# EAGLE design signal_generator (EAGLE 9.3.1)
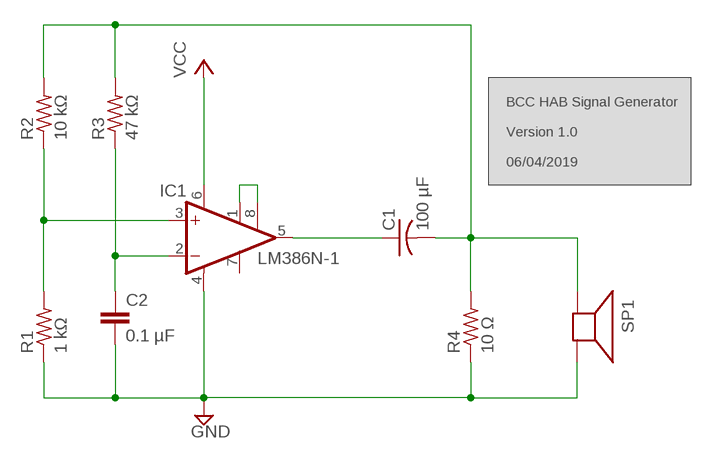
[diagram p0: schematic, sheet 1]

## Parts
C1  100 µF  C-US025-024X044  [C025-024X044]
C2  0.1 µF  C2,5-3  [C2.5-3]
IC1  LM386N-1  [DIL08]
R1  1 kΩ  R-US_0204/7  [0204/7]
R2  10 kΩ  R-US_0204/7  [0204/7]
R3  47 kΩ  R-US_0204/7  [0204/7]
R4  10 Ω  R-US_0204/7  [0204/7]
SP1  SPEAKER/AL60P  [AL60P]

## Nets
GND: C2.2 IC1.4(GND) R1.1 R4.1 SP1.2(-)
OUT: C1.2 R2.2 R3.2 R4.2 SP1.1(+)
PIN1-8: IC1.1(GAIN) IC1.8(GAIN)
PIN2: C2.1 IC1.2(-IN) R3.1
PIN3: IC1.3(+IN) R1.2 R2.1
PIN5: C1.1 IC1.5(OUT)
VCC: IC1.6(VS)
Unconnected: IC1.7(BYPASS)

## Notes on the sheet
- BCC HAB Signal Generator
  
  Version 1.0
  
  06/04/2019

## Library data of the parts
C1 = adafruit:C-US: CAPACITOR, American symbol
C2 = capacitor-wima:C: CAPACITOR naming: grid - package width
IC1 = linear:LM386?-*: Low Voltage Audio Power Amplifier Source: http://cache.national.com/ds/LM/LM386.pdf
R1-R4 = adafruit:R-US_: RESISTOR, American symbol
SP1 = adafruit:SPEAKER: SPEAKER Source: Buerklin Added PS12 (for part # PS1240 piezo) http://www.ladyada.net/library/pcb/eaglelibrary.html

## Board
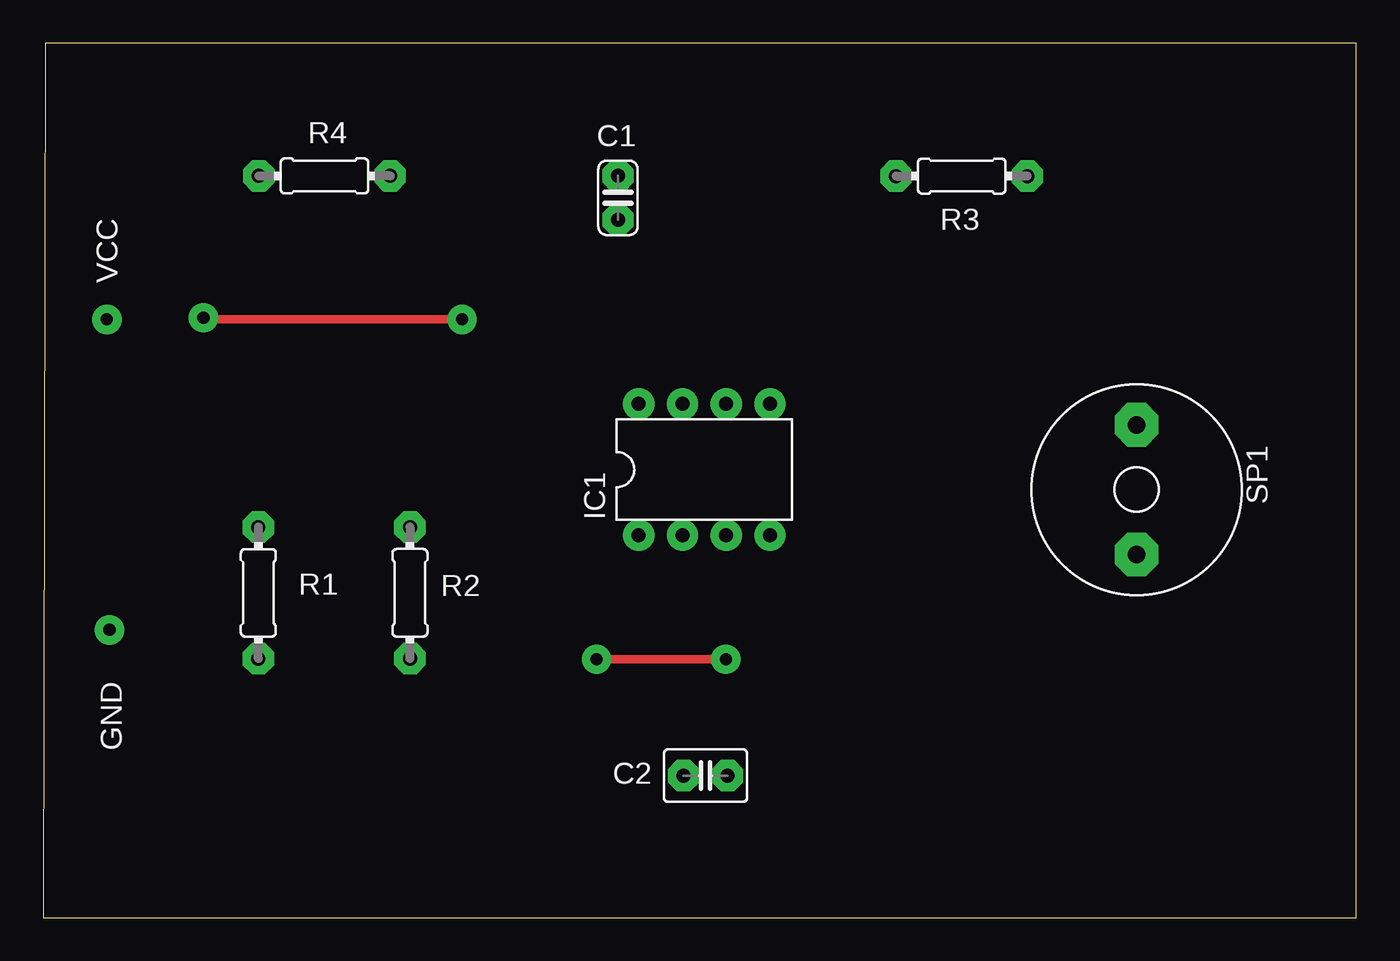
[diagram p1: board, top side]
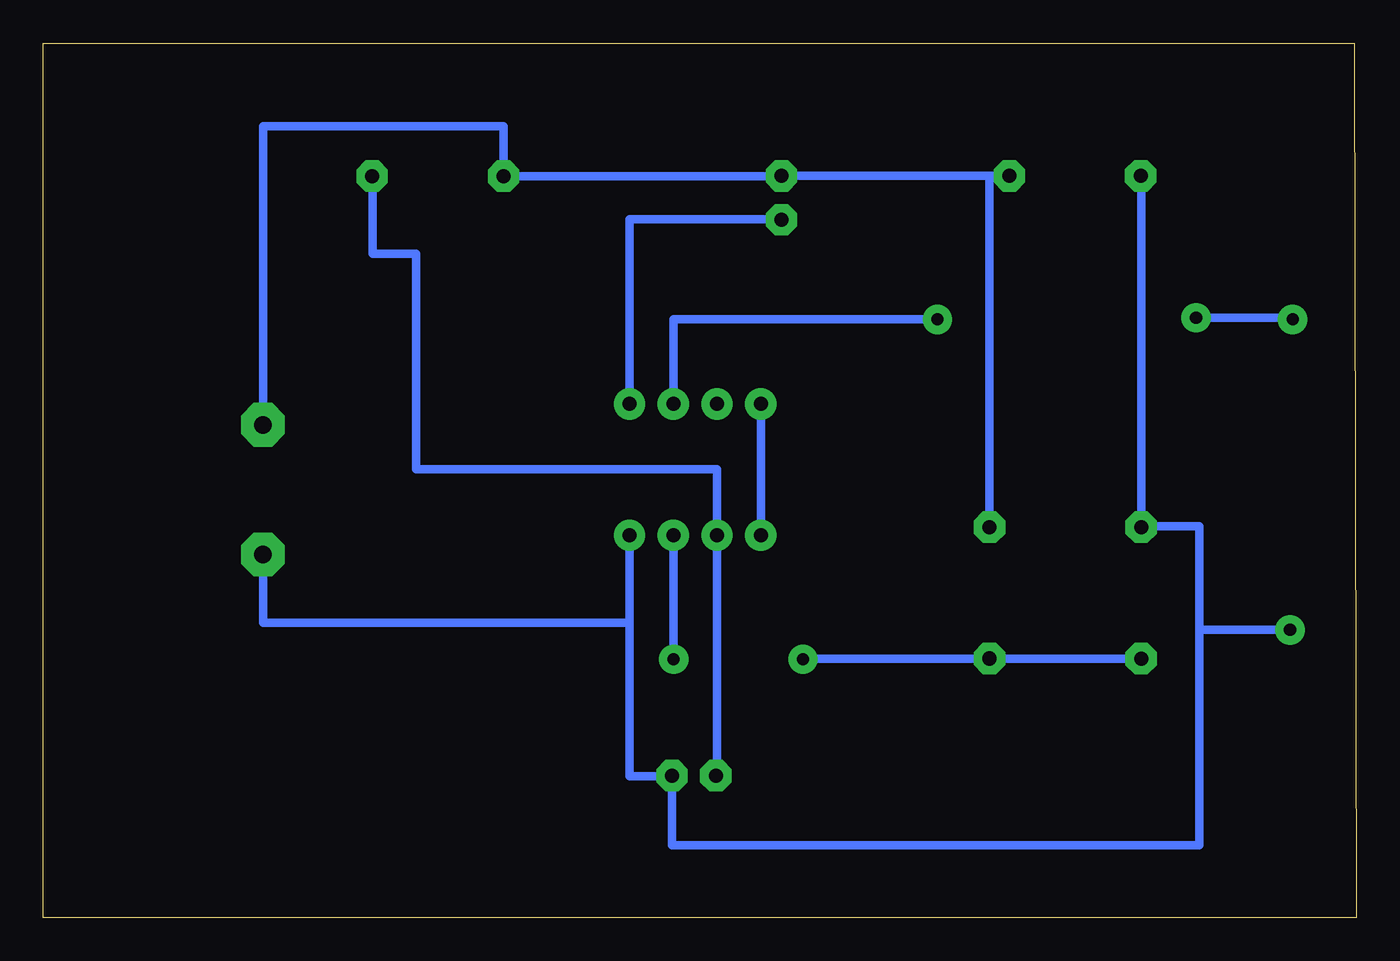
[diagram p2: board, bottom side, seen from below]

Size 76.18 x 50.72 mm. Coordinates in mm from the lower left corner, seen from the top.
Outline: 0,0 76.18,0 76.18,50.72 0.13,50.72 0,0
Copper layers (1*16): Top 0.035mm / dielectric 1.5mm / Bottom 0.035mm
Design rules "voltera-dru *": minimum track width 10mil, minimum drill 0.4mm, track to track 10mil, track to pad 10mil, pad to pad 0.6mm, via to via 0.6mm, smd to smd 0mil, copper to edge 0mil, drill to drill 0.8mm, minimum pad ring 0.5mm, minimum via ring 0.5mm, stop-mask expansion 4mil, vias tented up to drill 0mil, thermal gap 10mil

### Footprints (pad centres in the part's own frame; a part is rotated, then mirrored left to right if it is on the bottom)
C025-024X044 = drill 0.813 pad 1.422 octagon: 1 -1.27,0; 2 1.27,0
C2.5-3 = drill 0.813 pad 1.6 octagon: 1 -1.27,0; 2 1.27,0
DIL08 = drill 0.813 pad 1.27: 1 -3.81,-3.81; 2 -1.27,-3.81; 3 1.27,-3.81; 4 3.81,-3.81; 5 3.81,3.81; 6 1.27,3.81; 7 -1.27,3.81; 8 -3.81,3.81
0204/7 = drill 0.813 pad 1.676 octagon: 1 -3.81,0; 2 3.81,0
AL60P = drill 1.016 pad 2.54 octagon: 1 -3.759,0; 2 3.759,0

### Placement (x,y rotation side)
C1  33.35,41.75 90 top
C2  38.43,8.25 0 top
IC1  38.36,25.99 0 top
R1  12.49,18.85 270 top
R2  21.28,18.85 90 top
R3  53.28,43.01 180 top
R4  16.32,43.02 0 top
SP1  63.43,24.83 270 top

### Tracks (layer width: path | path; a pad name or v marks a point on that pad's centre or on a via)
GND  (via drill 0.7 pad 1.5)
  Bottom 0.5: IC1.4 42.17,17.1 | 42.17,17.1 42.17,8.2 39.7,8.2 | 39.7,8.2 C2.2 | R1.1 12.49,26 | 12.49,26 12.49,26.36 | 39.7,8.2 39.7,4.2 9.1,4.2 9.1,16.7 | R4.1 12.49,43.02 12.49,26 | 12.49,26 R1.1 | SP1.2 63.43,17.1 42.17,17.1 | 9.1,16.7 v3.85,16.7 | 9.1,16.7 9.1,22.7 12.49,22.7 R1.1
OUT
  Bottom 0.5: 21.28,43.02 R2.2 | R4.2 21.28,43.02 | 21.28,43.02 C1.2 R3.2 49.47,45.9 63.43,45.9 SP1.1
PIN1-8
  Bottom 0.5: IC1.8 IC1.1
PIN2
  Bottom 0.5: C2.1 37.09,8.32 IC1.2 37.09,26 54.55,26 54.55,38.5 57.08,38.5 57.08,43 R3.1
PIN3  (via drill 0.7 pad 1.3)
  Top 0.5: v39.6,15 v32.1,15
  Bottom 0.5: v39.6,15 39.63,15 IC1.3 | R1.2 R2.1 32.06,15.04 v32.1,15
PIN5
  Bottom 0.5: IC1.5 42.17,40.5 33.35,40.5 C1.1
VCC  (via drill 0.7 pad 1.5)
  Top 0.5: v24.3,34.7 9.3,34.7 v9.3,34.8
  Bottom 0.5: IC1.6 39.63,34.7 v24.3,34.7 | v9.3,34.8 3.7,34.8 v3.7,34.7

### Text on the board
tNames: VCC | GND